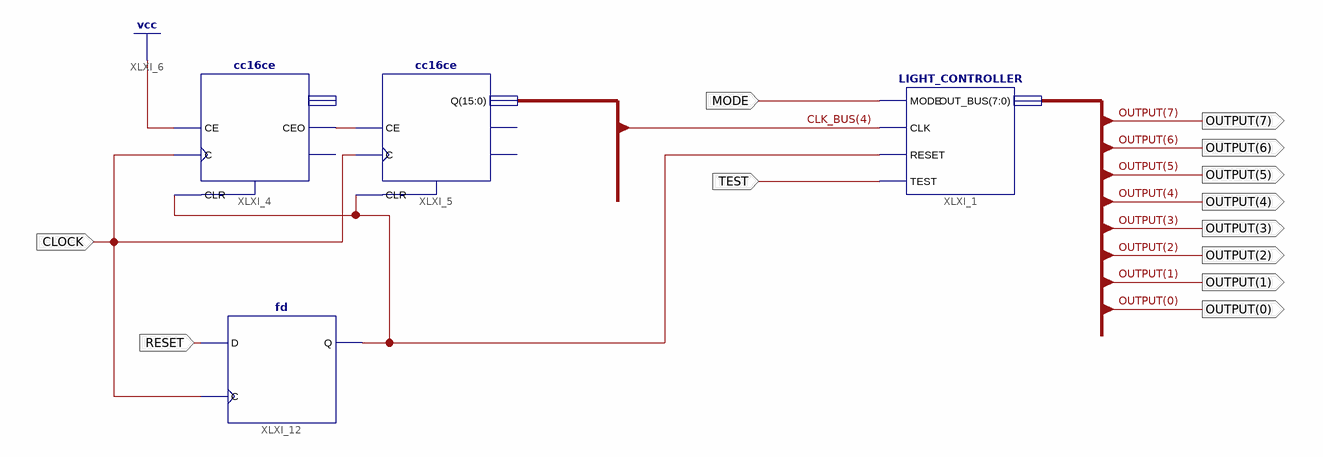
[diagram p0: schematic sheet 1]
// Xilinx ISE schematic TOP_SCHEME.sch (spartan3a) as structural Verilog: 4 symbols, 12 ports
module TOP_SCHEME (
  input  CLOCK,
  input  RESET,
  input  MODE,
  input  TEST,
  output [7:0] OUTPUT
);

  wire XLXN_16, XLXN_30;
  wire [15:0] CLK_BUS;

  cc16ce XLXI_4 (.C(CLOCK), .CE(1'b1), .CLR(XLXN_30), .CEO(XLXN_16));  // open: Q, TC
  cc16ce XLXI_5 (.C(CLOCK), .CE(XLXN_16), .CLR(XLXN_30), .Q(CLK_BUS));  // open: CEO, TC
  fd XLXI_12 (.C(CLOCK), .D(RESET), .Q(XLXN_30));
  LIGHT_CONTROLLER XLXI_1 (.MODE(MODE), .CLK(CLK_BUS[4]), .RESET(XLXN_30), .TEST(TEST), .OUT_BUS(OUTPUT));
endmodule
